# Altium schematic sheet StabImp.SchDoc
size A4
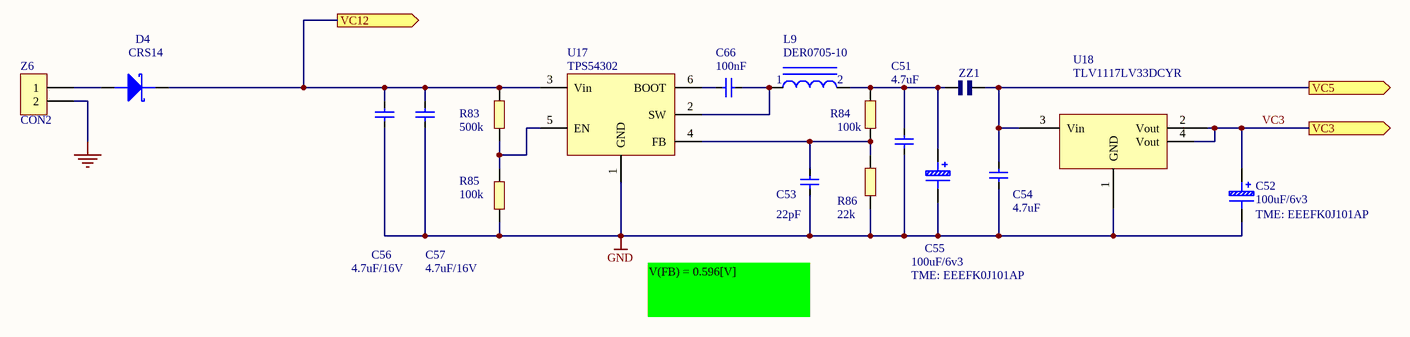
[diagram p0: StabImp.SchDoc]

## Parts
C51  4.7uF  [0805C]
C52  100uF/6v3  [CAP_SMD_ELEK_D]
C53  22pF  [0603C]
C54  4.7uF  [0805C]
C55  100uF/6v3  [CAP_SMD_ELEK_D]
C56  4.7uF/16V  [0805C]
C57  4.7uF/16V  [0805C]
C66  100nF  [0603C]
D4  CRS14  [1206D]
L9  DER0705-10  [DER0705_1]
R83  500k  [0603R]
R84  100k  [0603R]
R85  100k  [0603R]
R86  22k  [0603R]
U17  TPS54302  [SOT-23-1.1]
U18  TLV1117LV33DCYR  [SOT223]
Z6  CON2  [ARC-2-5.08]
ZZ1  ZWORA  [ZW3]  (value not drawn)

## Ports
VC3 (out), VC5 (out), VC12 (out)

## Nets
GND: C51.1 C52.1 C53.1 C54.1 C55.1 C56.1 C57.1 R85.2 R86.2 U17.1(GND) U18.1(GND) Z6.2
VC3: C52.2 U18.2(Vout) U18.4(Vout) ; port VC3
VC5: C54.2 U18.3(Vin) ZZ1.2 ; port VC5
VC12: C56.2 C57.2 D4.K R83.1 U17.3(Vin) ; port VC12
NetC51_2: C51.2 C55.2 L9.2 R84.1 ZZ1.1
NetC53_2: C53.2 R84.2 R86.1 U17.4(FB)
NetC66_1: C66.1 L9.1 U17.2(SW)
NetC66_2: C66.2 U17.6(BOOT)
NetD4_A: D4.A Z6.1
NetR83_2: R83.2 R85.1 U17.5(EN)

## Notes on the sheet
- V(FB) = 0.596[V]

## Library data of the parts
C51 C53 C54 C56 C57 C66 = CAP
C52 C55 = CapTantal: EEEFK0J101AP; TME: EEEFK0J101AP
D4 = DIODE SCHOTTKY: Schottky Diode; Dostawca: TME; Dostawca.Symbol: CRS14
L9 = CEWKA_1: Dostawca.Symbol: DER0705-15; Dostawca: TME
R83-R86 = RES3
U18 = LD1117V33: Dostawca.Symbol: LD1117DT33; Dostawca: TME
Z6 = CON2: Connector